# Altium schematic sheet MIDI.SchDoc: Audio_Moduloop - MIDI
size A; Date: 2/27/2024; DrawnBy: Team 28: Ryan Gordon, Conor Curtin, Evan Roveili, Shawn Colby; DocumentNumber: 2; Revision: V1; SheetNumber: 2; SheetTotal: 9
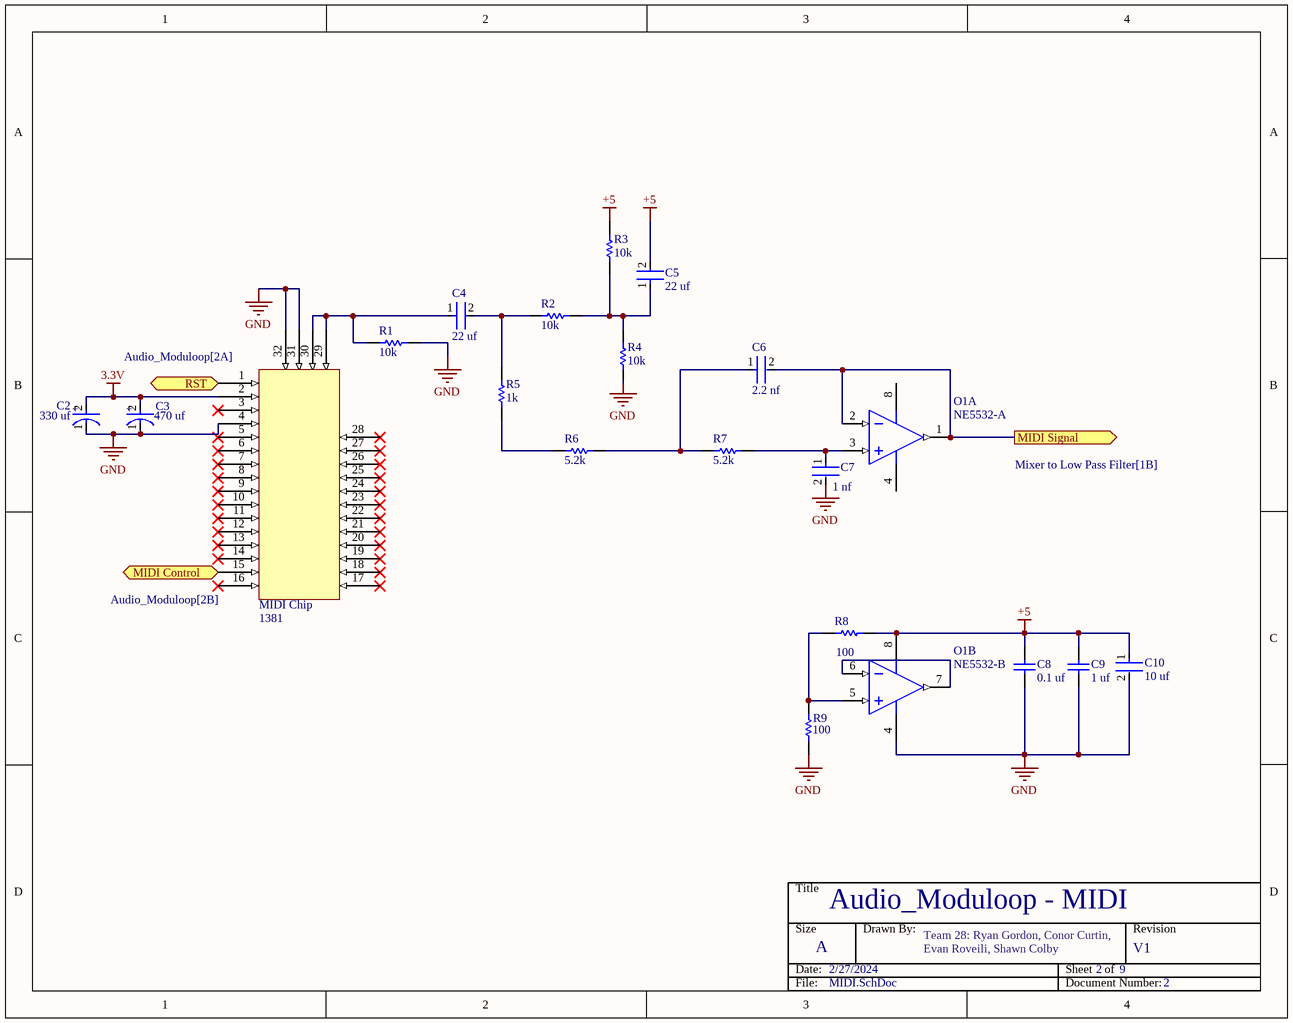
[diagram p0: MIDI.SchDoc]

## Parts
C2  330 uf  [FP-RAD-TH-D_6_3_0_5-L_11-MFG]
C3  470 uf  [FP-RAD-TH-D_10_0_5-L_16_1-MFG]
C4  22 uf  [FP-RCEWM1-MFG]
C5  22 uf  [FP-RCEWM1-MFG]
C6  2.2 nf  [FP-RCE0DB-MFG]
C7  1 nf  [FP-RCE0DB-MFG]
C8  0.1 uf  [CAPC2013X135X45ML10T25]
C9  1 uf  [CAPC2013X145X50LL20T25]
C10  10 uf  [FP-C0805C-DG-MFG]
MIDI_Chip  1381  [FEATHERWING]
O1  NE5532-A  [ONSC-SOIC-8-751-07_V]  (parts A,B of 2)
R1  10k  [RESC2013X60X35NL10T20]
R2  10k  [RESC2013X60X35NL10T20]
R3  10k  [RESC2013X60X35NL10T20]
R4  10k  [RESC2013X60X35NL10T20]
R5  1k  [RESC2013X60X40LL20T25]
R6  5.2k  [RESC2013X70X40LL20T20]
R7  5.2k  [RESC2013X70X40LL20T20]
R8  100  [RESC2013X60X40ML20T25]
R9  100  [RESC2013X60X40ML20T25]

## Ports
MIDI Control (bidir, see Audio_Moduloop[2B]), MIDI Signal (out, see Mixer to Low Pass Filter[1B]), RST (bidir, see Audio_Moduloop[2A])

## Nets
3.3V: C2.2(A) C3.2(A) MIDI_Chip.2
+5: C5.2 C8.1 C9.1 C10.1 O1.8(V+) R3.1 R8.2
GND: C2.1(C) C3.1(C) C7.2 C8.2 C9.2 C10.2 MIDI_Chip.4 MIDI_Chip.31 MIDI_Chip.32 O1.4(V-) R1.2 R4.2 R9.1
MIDI Control: MIDI_Chip.15 ; port MIDI Control
MIDI Signal: C6.2 O1.1(OUTA) O1.2(INA-) ; port MIDI Signal
RST: MIDI_Chip.1 ; port RST
NetC4_1: C4.1 MIDI_Chip.29 MIDI_Chip.30 R1.1
NetC4_2: C4.2 R2.1 R5.2
NetC5_1: C5.1 R2.2 R3.2 R4.1
NetC6_1: C6.1 R6.2 R7.1
NetC7_1: C7.1 O1.3(INA+) R7.2
NetO1_5: O1.5(INB+) R8.1 R9.2
NetO1_6: O1.6(INB-) O1.7(OUTB)
NetR5_1: R5.1 R6.1

Not connected (* = marked no-connect by the designer): MIDI_Chip 3* 5* 6* 7* 8* 9* 10* 11* 12* 13* 14* 16* 17* 18* 19* 20* 21* 22* 23* 24* 25* 26* 27* 28*

## Notes on the sheet
- Title
- Size
- Date:
- A
- Drawn By:
- Sheet    of
- Revision
- File:
- Document Number:
- (in symbol CMP-05427-000639-1) +
- (in symbol CMP-05427-001214-1) +

## Library data of the parts
C2 = CMP-05427-001214-1: Aluminum Electrolytic Capacitors (Radial Lead Type) 330uF ±20% 6.3V; ESR (Equivalent Series Resistance): 130mR; Lead Diameter: 0.5mm; Ripple Current: 455mA; Polarity: Polar; Life (Hours): 2000Hour; Package Quantity: 2000; RoHS Compliant: Yes; Diameter: 6.3mm; Features: General Purpose; Voltage Rating: 6.3V; Length: 11.2mm; Voltage Rating (DC): 6.3V; Mount: Through Hole; Min Operating Temperature: -40°C; Height: 11.2mm; Termination: Radial; Radiation Hardening: No; Capacitance: 330uF; Case/Package: Radial; Packaging: Ammo Pack; Tolerance: 20%; Height - Seated (Max): 0.5inch; Series: FR; Lead Pitch: 5mm; Max Operating Temperature: 105°C; Impedance: 130mR
C3 = CMP-05427-000639-1: Aluminum Electrolytic Capacitors (Radial Lead Type) AEC-Q200 Qualified 470uF ±20% 25V; Dielectric Material: Aluminium; Leakage Current: 3uA; ESR (Equivalent Series Resistance): 68mR; Lead Diameter: 0.6mm; Ripple Current: 1.05A; Life (Hours): 3000Hour; Termination: Radial; Length: 16mm; RoHS Compliant: Yes; Series: FC; Tolerance: 20%; Package Quantity: 200; Radiation Hardening: No; Case/Package: Radial; Voltage Rating: 25V; Voltage: 25V; Contact Plating: Tin; Construction: RADIAL; Max Operating Temperature: 105°C; Min Operating Temperature: -55°C; REACH SVHC: No SVHC; Height: 16mm; Ratings: AEC-Q200; Packaging: Bulk; Mount: Through Hole; Diameter: 10mm; Capacitance: 470uF; Impedance: 68mR; Height - Seated (Max): 0.63inch; Lead Free: Lead Free; Ripple Current (AC): 1.05A; Voltage Rating (DC): 25V; Lead Pitch: 5mm; Size: 16mm
C4 C5 = CMP-06035-003622-1: CAP CER 22UF 25V X7R RADIAL; Tolerance: 20%; Lead Diameter: 0.5mm; Lead/Base Style: Formed Leads; Height - Seated (Max): 0.295inch; Height: 7.5mm; Capacitance: 22uF; Max Operating Temperature: 125°C; Package Quantity: 1500; Case/Package: Radial; Length: 0.217inch; Lead Pitch: 0.197inch; Voltage Rating (DC): 25V; Ratings: AEC-Q200; Mount: Through Hole; Packaging: Tape and Reel; Voltage Rating: 25V; Min Operating Temperature: -55°C; Width: 0.157inch; Resistor Type: Ceramic; Termination: Radial; Dielectric: X7R
C6 = CMP-06035-010479-1: Cap Ceramic 1nF 50V X7R ±10% Radial 2.5mm +125°C Ammo Pack; Lead/Base Style: Straight; Lead Diameter: 0.5mm; Min Operating Temperature: -55°C; Length: 0.142inch; Max Operating Temperature: 125°C; Resistor Type: Ceramic; Height: 3.5mm; Lead Pitch: 0.098inch; Case/Package: Radial; Capacitance: 1nF; Ratings: AEC-Q200; Voltage Rating (DC): 50V; Package Quantity: 2000; Mount: Through Hole; Voltage Rating: 50V; Tolerance: 10%; Height - Seated (Max): 0.138inch; Dielectric: X7R; Termination: Radial; Width: 0.098inch; Packaging: Tape and Reel
C7 = CMP-06035-009321-1: Cap Ceramic 470pF 100V X7R ±10% Radial 2.5mm +125°C Ammo Pack; Lead Diameter: 0.5mm; Lead/Base Style: Straight; Termination: Radial; Width: 0.098inch; Mount: Through Hole; Package Quantity: 2000; Height - Seated (Max): 0.138inch; Height: 3.5mm; Voltage Rating: 100V; Min Operating Temperature: -55°C; Dielectric: X7R; Max Operating Temperature: 125°C; Voltage Rating (DC): 100V; Capacitance: 470pF; Ratings: AEC-Q200; Packaging: Tape and Reel; Tolerance: 10%; Resistor Type: Ceramic; Lead Pitch: 0.098inch; Case/Package: Radial; Length: 0.142inch
C8 = CMP-2100-03644-1: Chip Capacitor, 0.1 uF, +/- 10%, 50 V, -55 to 125 degC, 0805 (2012 Metric), RoHS, Tape and Reel; Manufacturer: Murata; Voltage: 50V; Capacitance: 100nF; Insulation Resistance: 10GR; Dielectric Material: Ceramic; Dielectric: X7R; Package Description: 2-Pin Surface Mount Device, Body 2 x 1.25 mm; Manufacturer URL: http://www.murata.com/; Case Code (Imperial): 0805; Datasheet URL: http://psearch.en.murata.com/capacitor/product/GRM21BR71H104KA01%23.pdf; Termination: SMD/SMT; Lead Free: LeadFree; Package Quantity: 1; Mount: SurfaceMount; REACH SVHC: Unknown; Thickness: 0.053inch; Height: 1.25mm; Case/Package: 0805; Voltage Rating: 50V; Width: 0.049inch; Case Code (Metric): 2012; Material: Ceramic; Min Operating Temperature: -55degC; RoHSCompliant: true; Datasheet Version: 42675.0; Voltage Rating (DC): 50V; Tolerance: 10%; Package Reference: 0805; Depth: 1.25mm; Length: 2mm; Max Operating Temperature: 125degC; Packaging: TapeandReel; Number of Pins: 2; Radiation Hardening: No
C9 = CMP-1036-04746-2: Manufacturer: Kemet; Part Number: C0805C105K4PACTU
C10 = CMP-2007-03243-2: CAP CER 10UF 10V X5R 0805; Manufacturer Part Number: C0805C106K8PACTU; Manufacturer: Kemet; 3DS Part Number: 220-00001; Tolerance: 10%; Temperature Coefficient: 15%; Material: Ceramic; Device Class L2: Capacitors; Device Class L1: Passive Components; ComponentLink2URL: https://content.kemet.com/datasheets/KEM_C1006_X5R_SMD.pdf; Height: 1.4mm; Lead Free: Yes; Digikey Description: CAP CER 10UF 10V X5R 0805; Octopart: https://octopart.com/c0805c106k8pactu-kemet-98697; Capacitance: 10uF; Value: 10uF; Temperature Range Low: -55°C; Temperature: -55°C to +85°C; Automotive: No; Mouser Description: CAP CER 10UF 10V X5R 0805; Ipc Land Pattern Name: CAPC200125X125; Temperature Range High: +85°C; Voltage: 10V; RoHS: TRUE; Device Class L3: Ceramic Capacitors; ComponentLink2Description: Datasheet; Voltage Rating: 10V; Package: C0805C-DG; Temperature Characteristic: X5R; Category: Cap
MIDI_Chip = CMP-00030-00003-3: Conn, Rect, PowerPoleHousing, PP180Series, Blue, 180A, 600V; Pins: 32
O1 = CMP-1310-00252-1: Internally Compensated Dual Low Noise Operational Amplifier, 6 to 40 V, 0 to 70 degC, 8-Pin SOIC, Pb-Free, Tape and Reel; Manufacturer: On Semiconductor; PartNumber: NE5532AD8R2G; SR Typ (V/uS): 9; VCC Min (V): 6; VCC Max (V): 40; GBW Typ (MHz): 10; PackageVersion: Rev. AK, 02/2011; ComponentLink2URL: http://www.onsemi.cn/pub_link/Collateral/NE5532-D.PDF; RoHS: TRUE; PackageReference: SOIC-8-751-07; ComponentLink2Description: Datasheet; PackageDescription: 8-Pin Small Outline Integrated Circuit, Body 4.9 x 3.9 mm, Pitch 1.27 mm; ComponentLink3URL: http://www.onsemi.com/pub_link/Collateral/751-07.PDF; ComponentLink1Description: Manufacturer URL; DatasheetVersion: Rev. 2; Packing: Tape and Reel; ComponentLink1URL: http://www.onsemi.com/; ComponentLink3Description: Package Specification; Mounting Technology: Surface Mount
R1-R4 = CMP-1659-00013-4: Chip Resistor, 10 KOhm, +/- 1%, 0.125 W, -55 to 155 degC, 0805 (2012 Metric), RoHS, Tape and Reel; Manufacturer: Yageo; Voltage Rating: 150 V; Mount: Surface Mount; ComponentLink1Description: Manufacturer URL; ComponentLink2URL: http://www.yageo.com/documents/recent/PYu-RC_Group_51_RoHS_L_04.pdf; Pins: 2; Length: 2 mm; Min Operating Temperature: -55 degC; Height: 0.5 mm; Mounting Technology: Surface Mount; RoHSCompliant: true; REACH SVHC: No SVHC; ComponentLink1URL: http://www.yageo.com/; Max Operating Temperature: 155 degC; PackageReference: 0805; DatasheetVersion: Rev. 4, 02/2016; Package Quantity: 5000; Packaging: Tape and Reel; ComponentLink2Description: Datasheet; PackageDescription: 2-Pin Surface Mounted Device, Body 2 x 1.25 mm
R5 = CMP-2001-00597-1: Manufacturer: Panasonic; Part Number: ERA6AEB152V
R6 R7 = CMP-2001-00567-1: Manufacturer: Panasonic; Part Number: ERJ6ENF6801V
R8 R9 = CMP-2001-00580-1: Manufacturer: Panasonic; Part Number: ERA6AEB101V